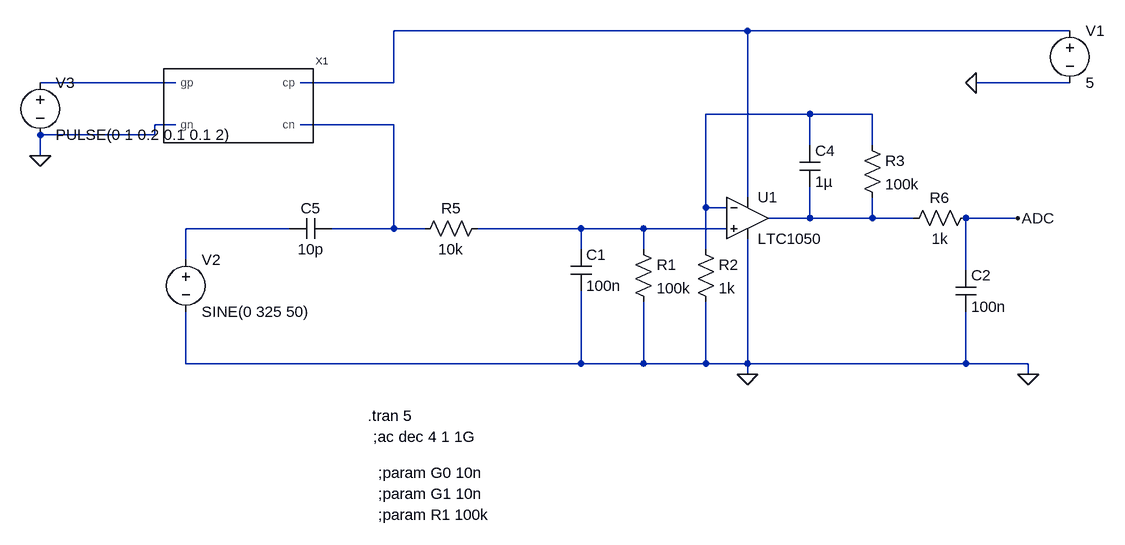
[diagram p0: schematic Filtre.asc]
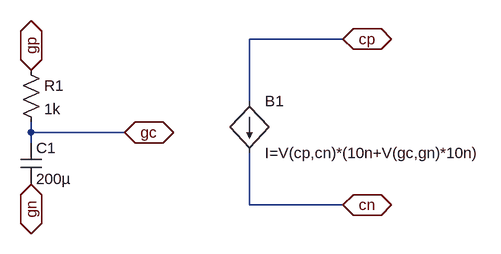
[diagram p1: sub-circuit capteur.asc]
Filtre.asc, the LTspice schematic file:
Version 4
SHEET 1 888 680
WIRE 336 -224 -208 -224
WIRE 832 -224 336 -224
WIRE -544 -144 -752 -144
WIRE -208 -144 -208 -224
WIRE -208 -144 -352 -144
WIRE 832 -144 688 -144
WIRE 432 -96 272 -96
WIRE 528 -96 432 -96
WIRE -544 -80 -576 -80
WIRE -208 -80 -352 -80
WIRE -576 -64 -576 -80
WIRE -576 -64 -752 -64
WIRE 432 -48 432 -96
WIRE 528 -48 528 -96
WIRE -752 -32 -752 -64
WIRE 336 32 336 -224
WIRE 272 48 272 -96
WIRE 304 48 272 48
WIRE 432 64 432 16
WIRE 432 64 368 64
WIRE 528 64 528 32
WIRE 528 64 432 64
WIRE 592 64 528 64
WIRE 752 64 672 64
WIRE -368 80 -528 80
WIRE -208 80 -208 -80
WIRE -208 80 -304 80
WIRE -160 80 -208 80
WIRE 80 80 -80 80
WIRE 176 80 80 80
WIRE 304 80 176 80
WIRE 80 112 80 80
WIRE 176 112 176 80
WIRE 272 112 272 48
WIRE -528 128 -528 80
WIRE 672 144 672 64
WIRE -528 288 -528 208
WIRE 80 288 80 176
WIRE 80 288 -528 288
WIRE 176 288 176 192
WIRE 176 288 80 288
WIRE 272 288 272 192
WIRE 272 288 176 288
WIRE 336 288 336 96
WIRE 336 288 272 288
WIRE 672 288 672 208
WIRE 672 288 336 288
WIRE 768 288 672 288
WIRE 336 304 336 288
WIRE 768 304 768 288
FLAG 336 304 0
FLAG 768 304 0
FLAG 752 64 ADC
FLAG -752 -32 0
FLAG 688 -144 0
SYMBOL cap 64 112 R0
SYMATTR InstName C1
SYMATTR Value 100n
SYMBOL cap 656 144 R0
SYMATTR InstName C2
SYMATTR Value 100n
SYMBOL cap 416 -48 R0
SYMATTR InstName C4
SYMATTR Value 1µ
SYMBOL res 160 96 R0
SYMATTR InstName R1
SYMATTR Value 100k
SYMBOL res 256 96 R0
SYMATTR InstName R2
SYMATTR Value 1k
SYMBOL res 512 -64 R0
SYMATTR InstName R3
SYMATTR Value 100k
SYMBOL res -64 64 R90
WINDOW 0 0 56 VBottom 2
WINDOW 3 32 56 VTop 2
SYMATTR InstName R5
SYMATTR Value 10k
SYMBOL res 688 48 R90
WINDOW 0 0 56 VBottom 2
WINDOW 3 32 56 VTop 2
SYMATTR InstName R6
SYMATTR Value 1k
SYMBOL OpAmps\\LTC1050 336 0 R0
SYMATTR InstName U1
SYMBOL voltage 832 -240 R0
SYMATTR InstName V1
SYMATTR Value 5
SYMBOL capteur -448 -112 R0
SYMATTR InstName X1
SYMBOL cap -304 64 R90
WINDOW 0 0 32 VBottom 2
WINDOW 3 32 32 VTop 2
SYMATTR InstName C5
SYMATTR Value 10p
SYMBOL voltage -528 112 R0
SYMATTR InstName V2
SYMATTR Value SINE(0 325 50)
SYMBOL voltage -752 -160 R0
SYMATTR InstName V3
SYMATTR Value PULSE(0 1 0.2 0.1 0.1 2)
TEXT -248 368 Left 2 !.tran 5
TEXT -240 400 Left 2 !;ac dec 4 1 1G
TEXT -232 456 Left 2 !;param G0 10n
TEXT -232 488 Left 2 !;param G1 10n
TEXT -232 520 Left 2 !;param R1 100k

capteur.asc, the sub-circuit schematic file:
Version 4
SHEET 1 880 680
WIRE 464 48 320 48
WIRE 320 144 320 48
WIRE -16 192 -16 176
WIRE 128 192 -16 192
WIRE -16 208 -16 192
WIRE 320 304 320 224
WIRE 464 304 320 304
FLAG -16 96 gp
IOPIN -16 96 BiDir
FLAG -16 272 gn
IOPIN -16 272 BiDir
FLAG 128 192 gc
IOPIN 128 192 BiDir
FLAG 464 48 cp
IOPIN 464 48 BiDir
FLAG 464 304 cn
IOPIN 464 304 BiDir
SYMBOL res -32 80 R0
SYMATTR InstName R1
SYMATTR Value 1k
SYMBOL cap -32 208 R0
SYMATTR InstName C1
SYMATTR Value 200µ
SYMBOL bi 320 144 R0
SYMATTR InstName B1
SYMATTR Value I=V(cp,cn)*(10n+V(gc,gn)*10n)

The netlist it stands for:
* Filtre.asc
C1 N007 0 100n
C2 ADC 0 100n
C4 N003 N005 1µ
R1 N007 0 100k
R2 N003 0 1k
R3 N003 N005 100k
R5 N007 N004 10k
R6 ADC N005 1k
XU1 N007 N003 N001 0 N005 LTC1050  ; pins In+ In- V+ V- OUT
V1 N001 0 5
XX1 N001 N004 N002 0 capteur
C5 N004 N006 10p
V2 N006 0 SINE(0 325 50)
V3 N002 0 PULSE(0 1 0.2 0.1 0.1 2)

* block symbol definitions
.subckt capteur cp cn gp gn
R1 gp gc 1k
C1 gc gn 200µ
B1 cp cn I=V(cp,cn)*(10n+V(gc,gn)*10n)
.ends capteur

.tran 5
;ac dec 4 1 1G
;param G0 10n
;param G1 10n
;param R1 100k
.lib LTC.lib
.backanno
.end